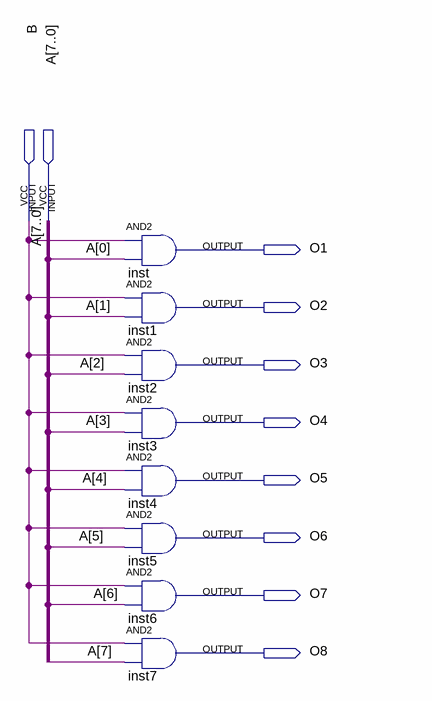
[diagram p0: schematic sheet]
// Quartus schematic 8x1_add.bdf as structural Verilog: 8 symbols, 10 pins
module \8x1_add  (
  input  B,
  input  [7:0] A,
  output O1,
  output O2,
  output O3,
  output O4,
  output O5,
  output O6,
  output O7,
  output O8
);

  and inst (O1, B, A[0]);
  and inst1 (O2, B, A[1]);
  and inst2 (O3, B, A[2]);
  and inst3 (O4, B, A[3]);
  and inst4 (O5, B, A[4]);
  and inst5 (O6, B, A[5]);
  and inst6 (O7, B, A[6]);
  and inst7 (O8, B, A[7]);
endmodule
